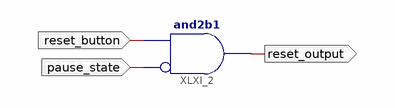
[diagram p0: schematic sheet 1]
// Xilinx ISE schematic resetTimer.sch (spartan6) as structural Verilog: 1 symbols, 3 ports
module resetTimer (
  input  reset_button,
  input  pause_state,
  output reset_output
);

  and XLXI_2 (reset_output, ~pause_state, reset_button);  // and2b1
endmodule
